# Altium schematic sheet ESP32+Power.SchDoc
size A; SheetNumber: 1; SheetTotal: 3
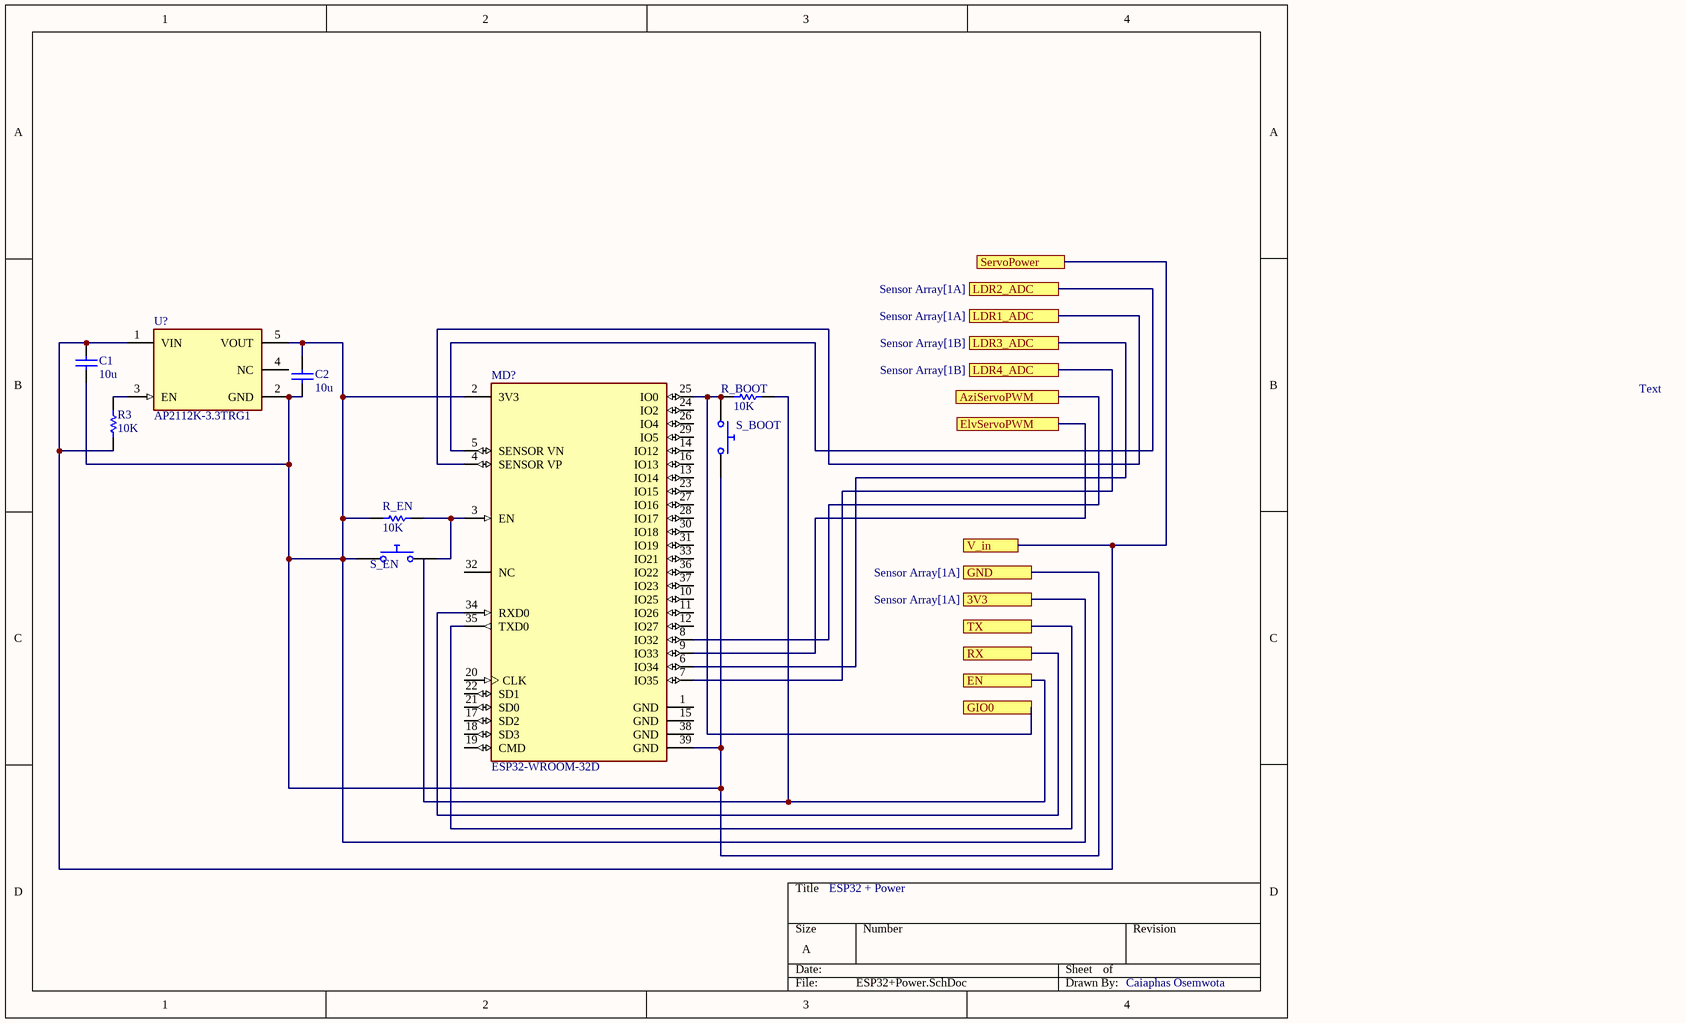
[diagram p0: ESP32+Power.SchDoc]

## Parts
C1  value 10u  (hidden comment: Capacitor)
C2  value 10u  (hidden comment: Capacitor)
MD?  ESP32-WROOM-32D  [FP-ESP32-WROOM-32D-MFG]
R3  value 10K  (hidden comment: Resistor)
R_BOOT  value 10K  (hidden comment: Resistor)
R_EN  value 10K  (hidden comment: Resistor)
S_BOOT  Push Button Normally Opened  (value not drawn)
S_EN  Push Button Normally Opened  (value not drawn)
U?  AP2112K-3.3TRG1  [FP-SOT25-IPC_A]

## Ports
3V3 (see Sensor Array[1A]), AziServoPWM, ElvServoPWM, EN, GIO0, GND (see Sensor Array[1A]), LDR1_ADC (see Sensor Array[1A]), LDR2_ADC (see Sensor Array[1A]), LDR3_ADC (see Sensor Array[1B]), LDR4_ADC (see Sensor Array[1B]), RX, ServoPower, TX, V_in

## Nets
3V3: C1.1 C2.1 C2.2 MD?.2(3V3) MD?.39(GND) R_EN.1 S_BOOT.2 S_EN.1 U?.2(GND) U?.5(VOUT) ; port GND, port 3V3
AziServoPWM: MD?.8(IO32) ; port AziServoPWM
ElvServoPWM: MD?.9(IO33) ; port ElvServoPWM
EN: R_BOOT.2 ; port EN
GIO0: MD?.25(IO0) R_BOOT.1 S_BOOT.1 ; port GIO0
LDR1_ADC: MD?.4(SENSOR_VP) ; port LDR1_ADC
LDR2_ADC: MD?.5(SENSOR_VN) ; port LDR2_ADC
LDR3_ADC: MD?.6(IO34) ; port LDR3_ADC
LDR4_ADC: MD?.7(IO35) ; port LDR4_ADC
RX: MD?.34(RXD0) ; port RX
ServoPower: C1.2 R3.1 U?.1(VIN) ; port V_in, port ServoPower
TX: MD?.35(TXD0) ; port TX
NetMD?_3: MD?.3(EN) R_EN.2 S_EN.2
NetR3_2: R3.2 U?.3(EN)

Not connected (* = marked no-connect by the designer): MD? 1(GND) 10(IO25) 11(IO26) 12(IO27) 13(IO14) 14(IO12) 15(GND) 16(IO13) 17(SD2) 18(SD3) 19(CMD) 20(CLK) 21(SD0) 22(SD1) 23(IO15) 24(IO2) 26(IO4) 27(IO16) 28(IO17) 29(IO5) 30(IO18) 31(IO19) 32(NC) 33(IO21) 36(IO22) 37(IO23) 38(GND); U? 4(NC)

## Notes on the sheet
- Text
- ESP32 + Power
- Caiaphas Osemwota

## Library data of the parts
C1 C2 = Capacitor: SimulationGenericComponent: True
MD? = CMP-194065-000003-1: WIFI MODULE 32MBITS SPI FLASH; Manufacturer: Espressif Systems; Max Supply Voltage: 3.6V; Nominal Supply Current: 500mA; Max Frequency: 2484MHz; Number Of Adc Channels: 16; Number Of Gpio: 32; Interface: I2C,SPI,UART,Ethernet,I2S,Other; Data Rate: 150Mbits/s; Min Supply Voltage: 3V; Bandwidth: 72MHz; Sensitivity: -98dBm; Octopart: https://octopart.com/esp32-wroom-32d-espressif+systems-91040050; Package: ESP32-WROOM-32D; ComponentLink2URL: https://www.espressif.com/sites/default/files/documentation/esp32-wroom-32d_esp32-wroom-32u_datasheet_en.pdf; Lead Free: Yes; Category: UNK; Mouser Description: Wi-Fi/BT BLE Module ESP32-D0WD, SPI Flash, UART, P; Device Class L1: Integrated Circuits (ICs); RoHS: TRUE; Temperature Range Low: -40°C; ComponentLink2Description: Datasheet; Digikey Description: WIFI MODULE 32MBITS SPI FLASH; Height: 3.2mm; Temperature: -40°C to +85°C; Manufacturer Part Number: ESP32-WROOM-32D; Device Class L3: Transceivers; Device Class L2: RF Semiconductors and Devices; Temperature Range High: +85°C; Automotive: No
R3 R_BOOT R_EN = Resistor: TC1: 0; SimulationGenericComponent: True; TC2: 0
S_BOOT S_EN = Push Button NO: closed: 0; Rclosed: 1m; Ropen: 1Meg; SimulationGenericComponent: True
U? = CMP-12756-000035-1: IC REG LINEAR 3.3V 600MA SOT25; Number of Regulators: 1; Output Type: Fixed; Polarity: Positive; Min Input Voltage: 2.5V; Max Input Voltage: 6V; Accuracy: 1.5%; Quiescent Current: 55uA; Dropout Voltage: 250mV; Min Operating Temperature: -40°C; Length: 3.1mm; Output Current: 600mA; Max Operating Temperature: 85°C; Package Quantity: 1; Output Voltage: 3.3V; Width: 1.7mm; Number of Outputs: 1; Packaging: Tape and Reel; Height: 1.3mm; Lead Free: Lead Free; Max Output Current: 600mA; Case/Package: SOT-23-5; Mount: Surface Mount; Number of Pins: 5